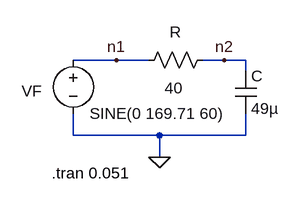
[diagram p0: schematic circuito1.asc]
circuito1.asc, the LTspice schematic file:
Version 4
SHEET 1 880 680
WIRE 112 96 48 96
WIRE 160 96 112 96
WIRE 272 96 240 96
WIRE 304 96 272 96
WIRE 304 112 304 96
WIRE 48 208 48 176
WIRE 176 208 48 208
WIRE 304 208 304 176
WIRE 304 208 176 208
WIRE 176 240 176 208
FLAG 176 240 0
FLAG 112 96 n1
FLAG 272 96 n2
SYMBOL voltage 48 80 R0
WINDOW 0 -77 62 Left 2
WINDOW 123 0 0 Left 0
WINDOW 39 0 0 Left 0
SYMATTR InstName VF
SYMATTR Value SINE(0 169.71 60)
SYMBOL res 144 112 R270
WINDOW 0 42 56 VTop 2
WINDOW 3 -10 53 VBottom 2
SYMATTR InstName R
SYMATTR Value 40
SYMBOL cap 288 112 R0
SYMATTR InstName C
SYMATTR Value 49µ
TEXT 16 264 Left 2 !.tran 0.051

The netlist it stands for:
* circuito1.asc
VF n1 0 SINE(0 169.71 60)
R n1 n2 40
C n2 0 49µ
.tran 0.051
.backanno
.end

* Results of the author's LTspice run, read from the files saved beside the schematic
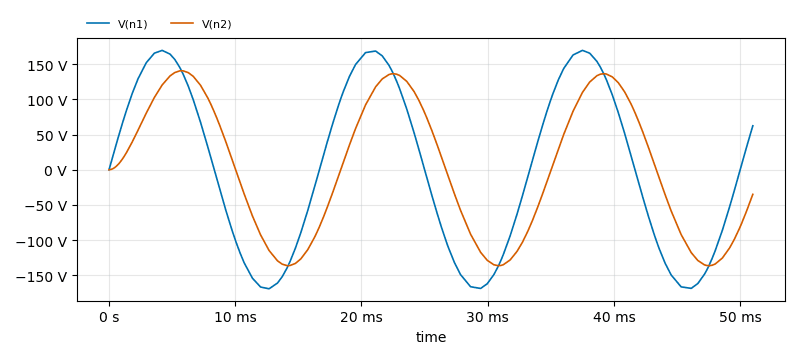
[diagram p1: Transient Analysis of circuito1.asc, plotted from the saved traces]
* Transient Analysis, 1 run:
*   V(n1): min -169.3 V, max 169.7 V, average 630.2 mV, rms 118.7 V, last 62.47 V
*   V(n2): min -136.5 V, max 140.7 V, average 1.983 V, rms 96.56 V, last -35.01 V